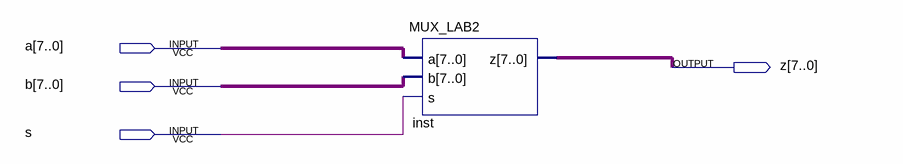
[diagram p0: schematic sheet]
// Quartus schematic MUX2_1_8.bdf as structural Verilog: 1 symbols, 4 pins
module MUX2_1_8 (
  input  [7:0] a,
  input  [7:0] b,
  input  s,
  output [7:0] z
);

  MUX_LAB2 inst (.a(a), .b(b), .s(s), .z(z));
endmodule
